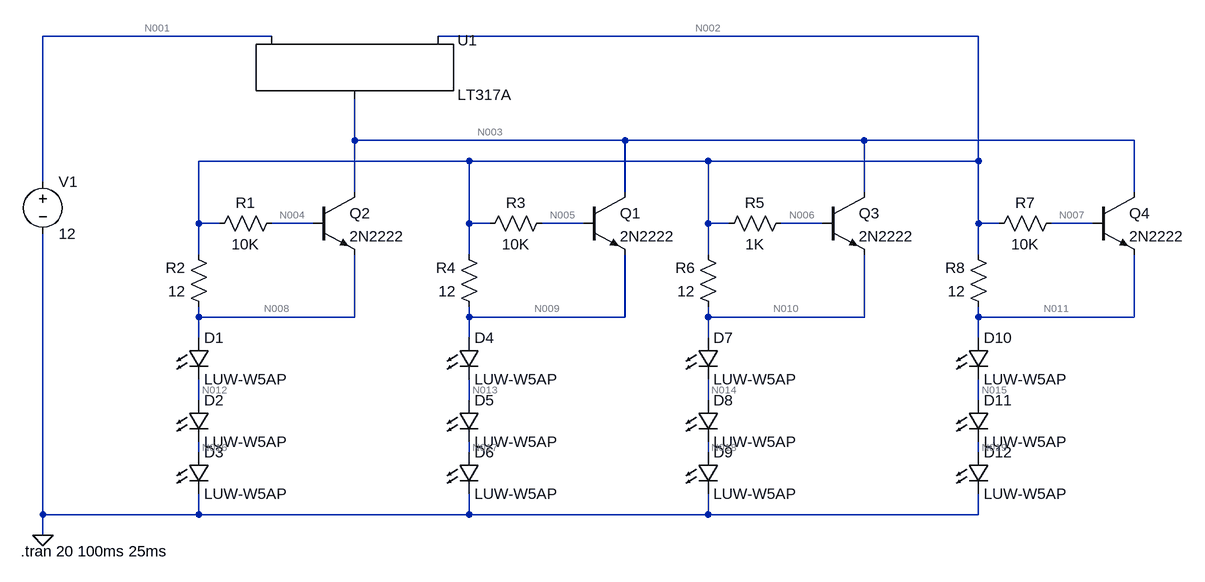
[diagram p0: schematic LED-Light-Simulation.asc]
LED-Light-Simulation.asc, the LTspice schematic file:
Version 4
SHEET 1 1464 936
WIRE 48 128 -304 128
WIRE 1136 128 304 128
WIRE 176 288 176 224
WIRE 592 288 176 288
WIRE 960 288 592 288
WIRE 1376 288 960 288
WIRE 352 320 -64 320
WIRE 720 320 352 320
WIRE 1136 320 1136 128
WIRE 1136 320 720 320
WIRE -304 352 -304 128
WIRE 176 368 176 288
WIRE 592 368 592 288
WIRE 960 368 960 288
WIRE 1376 368 1376 288
WIRE -64 416 -64 320
WIRE -32 416 -64 416
WIRE 112 416 48 416
WIRE 352 416 352 320
WIRE 384 416 352 416
WIRE 528 416 464 416
WIRE 720 416 720 320
WIRE 752 416 720 416
WIRE 896 416 832 416
WIRE 1136 416 1136 320
WIRE 1168 416 1136 416
WIRE 1312 416 1248 416
WIRE -64 464 -64 416
WIRE 352 464 352 416
WIRE 720 464 720 416
WIRE 1136 464 1136 416
WIRE -64 560 -64 544
WIRE 176 560 176 464
WIRE 176 560 -64 560
WIRE 352 560 352 544
WIRE 592 560 592 464
WIRE 592 560 352 560
WIRE 720 560 720 544
WIRE 960 560 960 464
WIRE 960 560 720 560
WIRE 1136 560 1136 544
WIRE 1376 560 1376 464
WIRE 1376 560 1136 560
WIRE -64 592 -64 560
WIRE 352 592 352 560
WIRE 720 592 720 560
WIRE 1136 592 1136 560
WIRE -64 688 -64 656
WIRE 352 688 352 656
WIRE 720 688 720 656
WIRE 1136 688 1136 656
WIRE -64 768 -64 752
WIRE 352 768 352 752
WIRE 720 768 720 752
WIRE 1136 768 1136 752
WIRE -304 864 -304 432
WIRE -64 864 -64 832
WIRE -64 864 -304 864
WIRE 352 864 352 832
WIRE 352 864 -64 864
WIRE 720 864 720 832
WIRE 720 864 352 864
WIRE 1136 864 1136 832
WIRE 1136 864 720 864
WIRE -304 896 -304 864
FLAG -304 896 0
SYMBOL PowerProducts\\LT317A 176 128 R0
SYMATTR InstName U1
SYMBOL voltage -304 336 R0
SYMATTR InstName V1
SYMATTR Value 12
SYMBOL npn 112 368 R0
SYMATTR InstName Q2
SYMATTR Value 2N2222
SYMBOL res 64 400 R90
WINDOW 0 0 56 VBottom 2
WINDOW 3 32 56 VTop 2
SYMATTR InstName R1
SYMATTR Value 10K
SYMBOL res -48 560 R180
WINDOW 0 36 76 Left 2
WINDOW 3 36 40 Left 2
SYMATTR InstName R2
SYMATTR Value 12
SYMBOL LED -80 592 R0
SYMATTR InstName D1
SYMATTR Value LUW-W5AP
SYMBOL LED -80 688 R0
SYMATTR InstName D2
SYMATTR Value LUW-W5AP
SYMBOL LED -80 768 R0
SYMATTR InstName D3
SYMATTR Value LUW-W5AP
SYMBOL npn 528 368 R0
SYMATTR InstName Q1
SYMATTR Value 2N2222
SYMBOL res 480 400 R90
WINDOW 0 0 56 VBottom 2
WINDOW 3 32 56 VTop 2
SYMATTR InstName R3
SYMATTR Value 10K
SYMBOL res 368 560 R180
WINDOW 0 36 76 Left 2
WINDOW 3 36 40 Left 2
SYMATTR InstName R4
SYMATTR Value 12
SYMBOL LED 336 592 R0
SYMATTR InstName D4
SYMATTR Value LUW-W5AP
SYMBOL LED 336 688 R0
SYMATTR InstName D5
SYMATTR Value LUW-W5AP
SYMBOL LED 336 768 R0
SYMATTR InstName D6
SYMATTR Value LUW-W5AP
SYMBOL npn 896 368 R0
SYMATTR InstName Q3
SYMATTR Value 2N2222
SYMBOL res 848 400 R90
WINDOW 0 0 56 VBottom 2
WINDOW 3 32 56 VTop 2
SYMATTR InstName R5
SYMATTR Value 1K
SYMBOL res 736 560 R180
WINDOW 0 36 76 Left 2
WINDOW 3 36 40 Left 2
SYMATTR InstName R6
SYMATTR Value 12
SYMBOL LED 704 592 R0
SYMATTR InstName D7
SYMATTR Value LUW-W5AP
SYMBOL LED 704 688 R0
SYMATTR InstName D8
SYMATTR Value LUW-W5AP
SYMBOL LED 704 768 R0
SYMATTR InstName D9
SYMATTR Value LUW-W5AP
SYMBOL npn 1312 368 R0
SYMATTR InstName Q4
SYMATTR Value 2N2222
SYMBOL res 1264 400 R90
WINDOW 0 0 56 VBottom 2
WINDOW 3 32 56 VTop 2
SYMATTR InstName R7
SYMATTR Value 10K
SYMBOL res 1152 560 R180
WINDOW 0 36 76 Left 2
WINDOW 3 36 40 Left 2
SYMATTR InstName R8
SYMATTR Value 12
SYMBOL LED 1120 592 R0
SYMATTR InstName D10
SYMATTR Value LUW-W5AP
SYMBOL LED 1120 688 R0
SYMATTR InstName D11
SYMATTR Value LUW-W5AP
SYMBOL LED 1120 768 R0
SYMATTR InstName D12
SYMATTR Value LUW-W5AP
TEXT -338 920 Left 2 !.tran 20 100ms 25ms

The netlist it stands for:
* LED-Light-Simulation.asc
XU1 N003 N002 N001 LT317A
V1 N001 0 12
Q2 N003 N004 N008 0 2N2222
R1 N004 N002 10K
R2 N008 N002 12
D1 N008 N012 LUW-W5AP
D2 N012 N016 LUW-W5AP
D3 N016 0 LUW-W5AP
Q1 N003 N005 N009 0 2N2222
R3 N005 N002 10K
R4 N009 N002 12
D4 N009 N013 LUW-W5AP
D5 N013 N017 LUW-W5AP
D6 N017 0 LUW-W5AP
Q3 N003 N006 N010 0 2N2222
R5 N006 N002 1K
R6 N010 N002 12
D7 N010 N014 LUW-W5AP
D8 N014 N018 LUW-W5AP
D9 N018 0 LUW-W5AP
Q4 N003 N007 N011 0 2N2222
R7 N007 N002 10K
R8 N011 N002 12
D10 N011 N015 LUW-W5AP
D11 N015 N019 LUW-W5AP
D12 N019 0 LUW-W5AP
.model D D
.lib standard.dio
.model NPN NPN
.model PNP PNP
.lib standard.bjt
.tran 20 100ms 25ms
.lib LTC.lib
.backanno
.end

* Results of the author's LTspice run, read from the files saved beside the schematic
* Operating Point, zero values left out:
*   V(n001) = 12 V
*   V(n002) = 9.356 V
*   V(n003) = 8.109 V
*   V(n004) = 8.721 V
*   V(n008) = 8.1 V
*   V(n012) = 5.4 V
*   V(n016) = 2.7 V
*   V(n005) = 8.721 V
*   V(n009) = 8.1 V
*   V(n013) = 5.4 V
*   V(n017) = 2.7 V
*   V(n006) = 8.783 V
*   V(n010) = 8.102 V
*   V(n014) = 5.401 V
*   V(n018) = 2.701 V
*   V(n007) = 8.721 V
*   V(n011) = 8.1 V
*   V(n015) = 5.4 V
*   V(n019) = 2.7 V
*   Ic(Q4) = 18.95 µA
*   Ib(Q4) = 63.49 µA
*   Ie(Q4) = -82.44 µA
*   Ic(Q3) = -9.332 µA
*   Ib(Q3) = 572.9 µA
*   Ie(Q3) = -563.6 µA
*   Ic(Q1) = 18.95 µA
*   Ib(Q1) = 63.49 µA
*   Ie(Q1) = -82.44 µA
*   Ic(Q2) = 18.95 µA
*   Ib(Q2) = 63.49 µA
*   Ie(Q2) = -82.44 µA
*   I(D12) = 104.8 mA
*   I(D11) = 104.8 mA
*   I(D10) = 104.8 mA
*   I(D9) = 105.1 mA
*   I(D8) = 105.1 mA
*   I(D7) = 105.1 mA
*   I(D6) = 104.8 mA
*   I(D5) = 104.8 mA
*   I(D4) = 104.8 mA
*   I(D3) = 104.8 mA
*   I(D2) = 104.8 mA
*   I(D1) = 104.8 mA
*   I(R8) = -104.7 mA
*   I(R7) = -63.49 µA
*   I(R6) = -104.6 mA
*   I(R5) = -572.9 µA
*   I(R4) = -104.7 mA
*   I(R3) = -63.49 µA
*   I(R2) = -104.7 mA
*   I(R1) = -63.49 µA
*   I(V1) = -419.5 mA
*   Ix(u1:1) = -47.5 µA
*   Ix(u1:2) = -419.5 mA
*   Ix(u1:3) = 419.5 mA